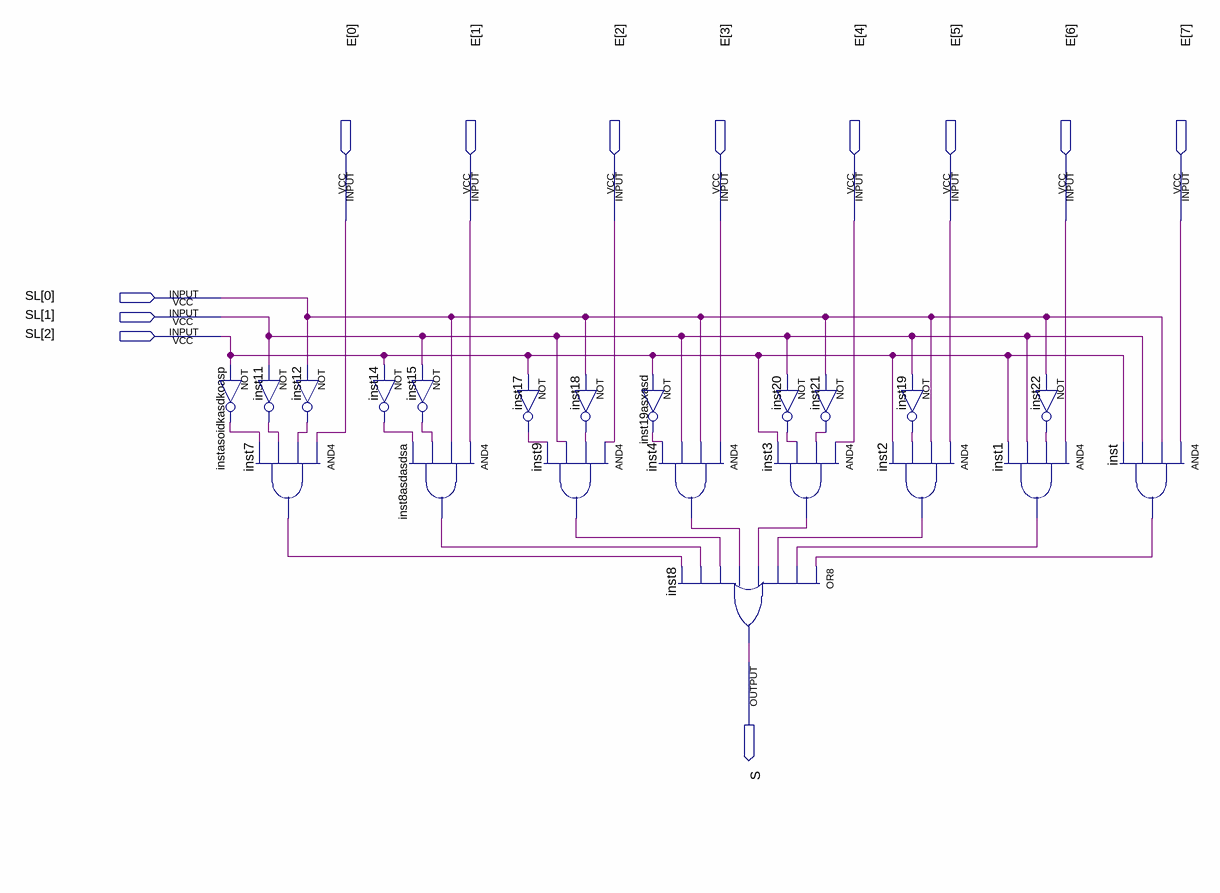
[diagram p0: schematic sheet]
// Quartus schematic mux8x3.bdf as structural Verilog: 21 symbols, 12 pins
module mux8x3 (
  input  [7:0] E,
  input  [2:0] SL,
  output S
);

  wire inst1_out, inst2_out, inst3_out, inst4_out, inst7_out, inst8asdasdsa_out, inst9_out, inst11_out,
       inst12_out, inst14_out, inst15_out, inst17_out, inst18_out, inst19_out, inst19asxasd_out, inst20_out,
       inst21_out, inst22_out, inst_out, instasoidkasdkoasp_out;

  not instasoidkasdkoasp (instasoidkasdkoasp_out, SL[2]);
  and inst7 (inst7_out, E[0], inst12_out, inst11_out, instasoidkasdkoasp_out);
  not inst11 (inst11_out, SL[1]);
  not inst12 (inst12_out, SL[0]);
  not inst14 (inst14_out, SL[2]);
  and inst8asdasdsa (inst8asdasdsa_out, E[1], SL[0], inst15_out, inst14_out);
  not inst15 (inst15_out, SL[1]);
  not inst17 (inst17_out, SL[2]);
  and inst9 (inst9_out, E[2], inst18_out, SL[1], inst17_out);
  not inst18 (inst18_out, SL[0]);
  not inst19asxasd (inst19asxasd_out, SL[2]);
  and inst4 (inst4_out, E[3], SL[0], SL[1], inst19asxasd_out);
  or inst8 (S, inst_out, inst1_out, inst2_out, inst3_out, inst4_out, inst9_out, inst8asdasdsa_out, inst7_out);
  not inst20 (inst20_out, SL[1]);
  and inst3 (inst3_out, E[4], inst21_out, inst20_out, SL[2]);
  not inst21 (inst21_out, SL[0]);
  not inst19 (inst19_out, SL[1]);
  and inst2 (inst2_out, E[5], SL[0], inst19_out, SL[2]);
  and inst1 (inst1_out, E[6], inst22_out, SL[1], SL[2]);
  not inst22 (inst22_out, SL[0]);
  and inst (inst_out, E[7], SL[0], SL[1], SL[2]);
endmodule
